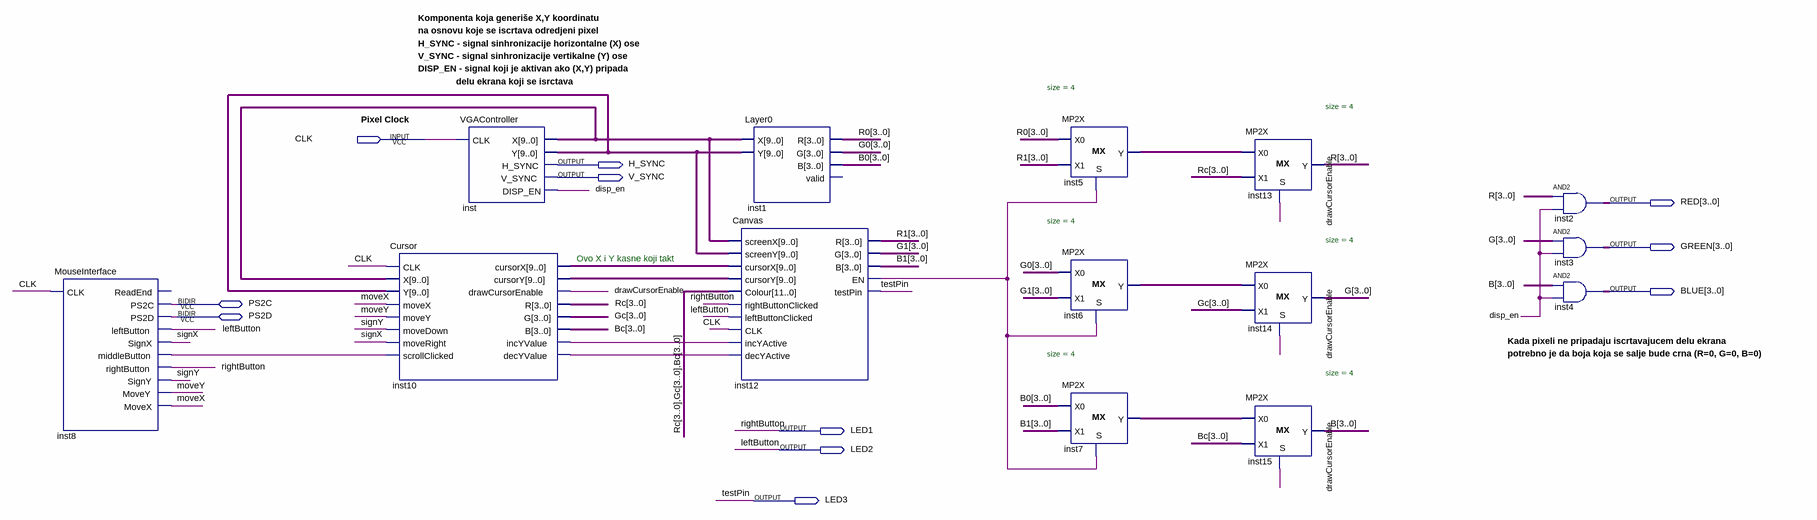
[diagram p0: schematic sheet]
// Quartus schematic Lab2Demo.bdf as structural Verilog: 14 symbols, 11 pins
module Lab2Demo (
  input  CLK,
  inout  PS2C,
  inout  PS2D,
  output H_SYNC,
  output V_SYNC,
  output [3:0] RED,
  output [3:0] GREEN,
  output [3:0] BLUE,
  output LED1,
  output LED2,
  output LED3
);

  wire disp_en, drawCursorEnable, inst8_middlebutton, inst10_decyvalue, inst10_incyvalue, inst12_en, moveX,
       moveY, signX, signY;
  wire [3:0] B, B0, B1, Bc, G, G0, G1, Gc, inst5_y, inst6_y, inst7_y, R, R0, R1, Rc;
  wire [9:0] inst10_cursorx, inst10_cursory, inst_x, inst_y;

  MouseInterface inst8 (
    .CLK(CLK), .leftButton(LED2), .SignX(signX), .middleButton(inst8_middlebutton), .rightButton(LED1),
    .SignY(signY), .MoveY(moveY), .MoveX(moveX), .PS2C(PS2C), .PS2D(PS2D));  // open: ReadEnd
  Cursor inst10 (
    .CLK(CLK), .X(inst_x), .Y(inst_y), .moveX(moveX), .moveY(moveY), .moveDown(signY), .moveRight(signX),
    .scrollClicked(inst8_middlebutton), .cursorX(inst10_cursorx), .cursorY(inst10_cursory),
    .drawCursorEnable(drawCursorEnable), .R(Rc), .G(Gc), .B(Bc), .incYValue(inst10_incyvalue),
    .decYValue(inst10_decyvalue));
  VGAController inst (.CLK(CLK), .X(inst_x), .Y(inst_y), .H_SYNC(H_SYNC), .V_SYNC(V_SYNC), .DISP_EN(disp_en));
  Layer0 inst1 (.X(inst_x), .Y(inst_y), .R(R0), .G(G0), .B(B0));  // open: valid
  Canvas inst12 (
    .screenX(inst_x), .screenY(inst_y), .cursorX(inst10_cursorx), .cursorY(inst10_cursory),
    .Colour({Rc, Gc, Bc}), .rightButtonClicked(LED1), .leftButtonClicked(LED2), .CLK(CLK),
    .incYActive(inst10_incyvalue), .decYActive(inst10_decyvalue), .R(R1), .G(G1), .B(B1), .EN(inst12_en),
    .testPin(LED3));
  MP2X #(.size(4)) inst5 (.S(inst12_en), .X0(R0), .X1(R1), .Y(inst5_y));
  MP2X #(.size(4)) inst6 (.S(inst12_en), .X0(G0), .X1(G1), .Y(inst6_y));
  MP2X #(.size(4)) inst7 (.S(inst12_en), .X0(B0), .X1(B1), .Y(inst7_y));
  MP2X #(.size(4)) inst13 (.S(drawCursorEnable), .X0(inst5_y), .X1(Rc), .Y(R));
  MP2X #(.size(4)) inst14 (.S(drawCursorEnable), .X0(inst6_y), .X1(Gc), .Y(G));
  MP2X #(.size(4)) inst15 (.S(drawCursorEnable), .X0(inst7_y), .X1(Bc), .Y(B));
  assign RED = R & {4{disp_en}};  // AND2 inst2, 4 bits wide
  assign GREEN = G & {4{disp_en}};  // AND2 inst3, 4 bits wide
  assign BLUE = B & {4{disp_en}};  // AND2 inst4, 4 bits wide

  // Other names for the same wires on the sheet: leftButton = LED2; rightButton = LED1; testPin = LED3

  // Notes on the sheet:
  //   Komponenta koja generiše X,Y koordinatu
  //   na osnovu koje se iscrtava odredjeni pixel
  //   H_SYNC - signal sinhronizacije horizontalne (X) ose
  //   V_SYNC - signal sinhronizacije vertikalne (Y) ose
  //   DISP_EN - signal koji je aktivan ako (X,Y) pripada
  //   delu ekrana koji se isrctava
  //   Pixel Clock
  //   Ovo X i Y kasne koji takt
  //   Kada pixeli ne pripadaju iscrtavajucem delu ekrana
  //   potrebno je da boja koja se salje bude crna (R=0, G=0, B=0)
endmodule
